# EAGLE design DWM Breakout (EAGLE 9.1.3)
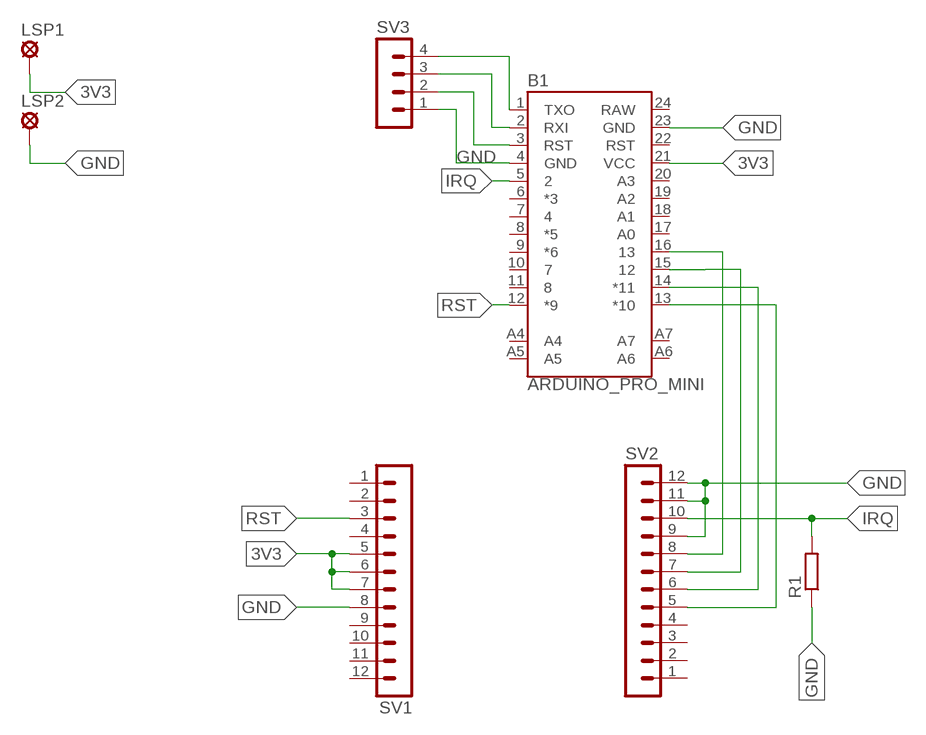
[diagram p0: schematic, sheet 1]

## Parts
B1  ARDUINO_PRO_MINI  [ARDUINO_PRO_MINI]
LSP1  SE14  [SE14]
LSP2  SE14  [SE14]
R1  R-EU_0207/10  [0207/10]
SV1  MA12-1  [MA12-1]
SV2  MA12-1  [MA12-1]
SV3  MA04-1  [MA04-1]

## Nets
3V3: B1.21(VCC) LSP1.MP SV1.5 SV1.6 SV1.7
GND: B1.4(GND) B1.23(GND) LSP2.MP R1.1 SV1.8 SV2.9 SV2.11 SV2.12 SV3.1
IRQ: B1.5 R1.2 SV2.10
N$2: B1.15 SV2.7
N$3: B1.1(TXO) SV3.4
N$4: B1.16 SV2.8
N$5: B1.14(*11) SV2.6
N$6: B1.13(*10) SV2.5
N$7: B1.2(RXI) SV3.3
N$8: B1.3(RST) SV3.2
RST: B1.12(*9) SV1.3
Unconnected: B1.6(*3) B1.7 B1.8(*5) B1.9(*6) B1.10 B1.11 B1.17(A0) B1.18(A1) B1.19(A2) B1.20(A3) B1.22(RST) B1.A4 B1.A5 B1.A6 B1.A7 SV1.1 SV1.2 SV1.4 SV1.9 SV1.10 SV1.11 SV1.12 SV2.1 SV2.2 SV2.3 SV2.4

## Power pins joined to a net without a drawn wire
RAW: B1.24(RAW)

## Library data of the parts
B1 = SparkFun-Boards:ARDUINO_PRO_MINI: SparkFun Pro Mini Pro Mini compatible footprint. Dimensions: 0.7 x 1.3" PCB Thickness: 0.8mm SparkFun Products: 3.3V/8MHz <https://www.sparkfun.com/products/11114> 5V/16MHz <https://www.sparkfun.com/products/11113>
LSP1 LSP2 = solpad:SE14: SOLDER PAD E1553, drill 1,4mm, distributor Buerklin, 07F820
R1 = rcl:R-EU_: RESISTOR, European symbol; SPICEPREFIX: R
SV1 SV2 = con-lstb:MA12-1: PIN HEADER; OC_FARNELL: unknown; OC_NEWARK: unknown
SV3 = con-lstb:MA04-1: PIN HEADER; OC_FARNELL: unknown; OC_NEWARK: unknown

## Net classes
0 default: width 0.305 mm

## Board
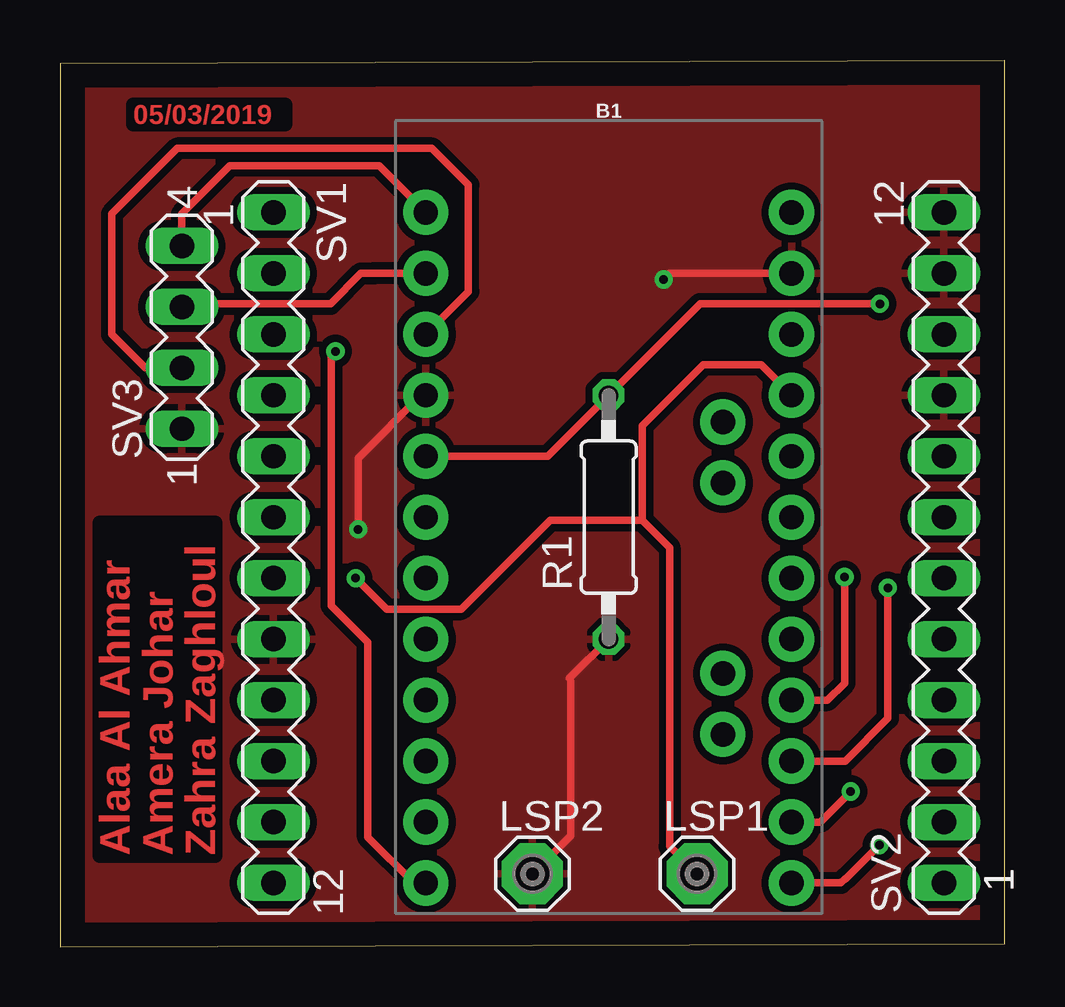
[diagram p1: board, top side]
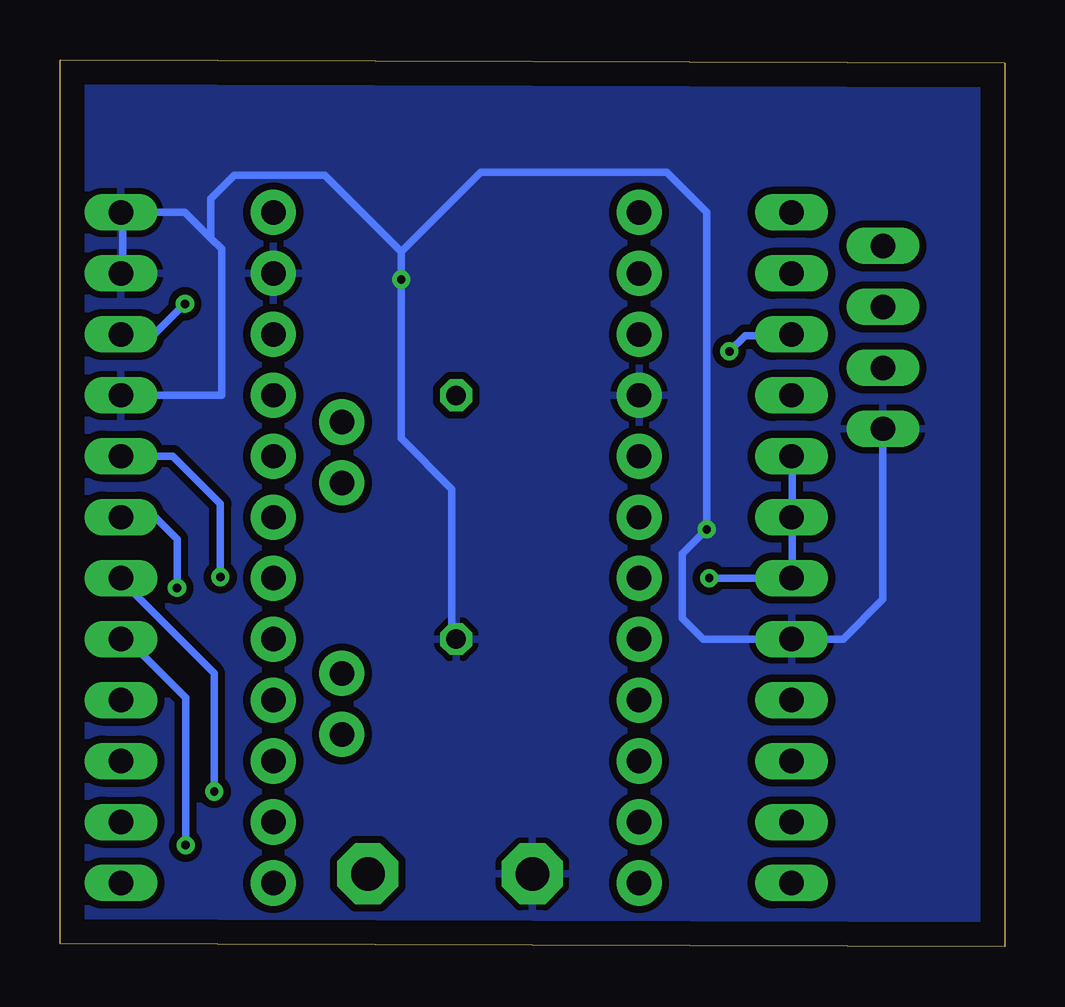
[diagram p2: board, bottom side, seen from below]

Size 39.37 x 36.96 mm. Coordinates in mm from the lower left corner, seen from the top.
Outline: 0,0 39.37,0.13 39.37,36.96 0,36.83 0,0
Copper layers (1*16): Top 0.035mm / dielectric 1.5mm / Bottom 0.035mm
Design rules "default": minimum track width 6mil, minimum drill 0.35mm, track to track 6mil, track to pad 6mil, pad to pad 6mil, via to via 6mil, smd to smd 6mil, copper to edge 40mil, drill to drill 6mil, minimum pad ring 10mil, minimum via ring 8mil, stop-mask expansion 4mil, vias tented up to drill 0mil, thermal gap 10mil

### Footprints (pad centres in the part's own frame; a part is rotated, then mirrored left to right if it is on the bottom)
ARDUINO_PRO_MINI = drill 1.016 pad 1.88: 1 -7.62,12.7; 2 -7.62,10.16; 3 -7.62,7.62; 4 -7.62,5.08; 5 -7.62,2.54; 6 -7.62,0; 7 -7.62,-2.54; 8 -7.62,-5.08; 9 -7.62,-7.62; 10 -7.62,-10.16; 11 -7.62,-12.7; 12 -7.62,-15.24; 13 7.62,-15.24; 14 7.62,-12.7; 15 7.62,-10.16; 16 7.62,-7.62; 17 7.62,-5.08; 18 7.62,-2.54; 19 7.62,0; 20 7.62,2.54; 21 7.62,5.08; 22 7.62,7.62; 23 7.62,10.16; 24 7.62,12.7; A4 4.763,1.429; A5 4.763,3.969; A6 4.763,-9.049; A7 4.763,-6.509
SE14 = drill 1.397 pad 2.54 octagon: MP 0,0
0207/10 = drill 0.813 octagon: 1 -5.08,0; 2 5.08,0
MA12-1 = drill 1.016 long: 1 -13.97,0; 2 -11.43,0; 3 -8.89,0; 4 -6.35,0; 5 -3.81,0; 6 -1.27,0; 7 1.27,0; 8 3.81,0; 9 6.35,0; 10 8.89,0; 11 11.43,0; 12 13.97,0
MA04-1 = drill 1.016 long: 1 -3.81,0; 2 -1.27,0; 3 1.27,0; 4 3.81,0

### Placement (x,y rotation side)
B1  22.86,17.91 0 top
LSP1  26.54,3.05 0 top
LSP2  19.69,3.05 0 top
R1  22.86,17.91 90 top
SV1  8.89,16.64 270 top
SV2  36.83,16.64 90 top
SV3  5.08,25.4 90 top

### Tracks (layer width: path | path; a pad name or v marks a point on that pad's centre or on a via)
3V3  (via drill 0.35)
  Top 0.305: v12.32,15.37 13.61,14.07 16.71,14.07 20.42,17.78 24.26,17.78 | 24.26,17.78 25.4,16.64 25.4,4.19 LSP1.MP | B1.21 29.21,24.26 26.8,24.26 24.26,21.72 24.26,17.78
  Bottom 0.305: 8.87,15.44 8.87,17.73 SV1.6 8.87,17.96 8.87,20.24 SV1.5 | 8.87,15.44 SV1.7 | v12.32,15.37 8.87,15.37 8.87,15.44
GND  (via drill 0.35)
  Top 0.305: v12.42,17.4 12.42,20.37 15.04,22.99 B1.4 | R1.1 21.23,11.19 21.27,11.08 21.27,4.63 LSP2.MP | B1.23 25.41,28.07 v25.15,27.81
  Bottom 0.305: 22.81,12.7 R1.1 23.04,12.93 23.04,19.07 25.15,21.19 v25.15,27.81 25.15,28.96 | 36.75,22.99 SV2.9 32.64,22.99 32.64,29.08 33.08,29.53 | SV2.11 36.75,28.24 36.75,30.53 SV2.12 34.16,30.61 33.08,29.53 | 25.15,28.96 21.83,32.28 14.1,32.28 12.42,30.61 v12.42,17.4 13.44,16.38 13.44,13.69 12.57,12.83 SV1.8 6.73,12.83 5.08,14.48 SV3.1 5.08,21.56 | 25.15,28.96 28.35,32.16 32.11,32.16 33.08,31.18 33.08,29.53
  pour Top (isolate 0.305): 39.24,36.83 39.24,0.13 0.13,0.13 0.13,36.83
  pour Bottom (isolate 0.305): 0.13,36.83 39.37,36.83 39.37,0.25 0.13,0.25
IRQ  (via drill 0.35)
  Top 0.305: v34.16,26.8 26.8,26.8 26.67,26.8 R1.2 20.32,20.45 B1.5
  Bottom 0.305: SV2.10 35.43,25.53 v34.16,26.8
N$2  (via drill 0.35)
  Top 0.305: v34.49,14.96 34.49,9.53 32.71,7.75 B1.15
  Bottom 0.305: v34.49,14.96 34.49,16.99 35.41,17.91 SV2.7
N$3
  Top 0.305: B1.1 13.3,32.54 7.08,32.54 5.08,30.54 5.08,29.34 SV3.4
N$4  (via drill 0.35)
  Top 0.305: v32.69,15.42 32.69,11 31.98,10.29 B1.16
  Bottom 0.305: v32.69,15.42 32.69,18.47 34.67,20.45 SV2.8
N$5  (via drill 0.35)
  Top 0.305: v32.94,6.48 31.67,5.21 B1.14
  Bottom 0.305: v32.94,6.48 32.94,11.41 36.75,15.21 SV2.6
N$6  (via drill 0.35)
  Top 0.305: v34.14,4.24 32.74,2.84 32.71,2.84 32.54,2.67 B1.13
  Bottom 0.305: v34.14,4.24 34.14,10.39 36.58,12.83 SV2.5
N$7
  Top 0.305: 13.08,28.07 12.99,28.07 | B1.2 13.08,28.07 | 13.08,28.07 12.54,28.07 11.27,26.8 5.21,26.8 SV3.3
N$8
  Top 0.305: B1.3 17.02,27.3 17.02,31.75 15.49,33.27 4.89,33.27 2.16,30.54 2.16,25.53 3.56,24.13 SV3.2
RST  (via drill 0.35)
  Top 0.305: B1.12 14.73,2.67 12.83,4.57 12.83,12.7 11.3,14.22 11.3,24.64 v11.48,24.82
  Bottom 0.305: SV1.3 8.84,25.48 10.82,25.48 v11.48,24.82

### Text on the board
Top: 05/03/2019 | Alaa Al Ahmar / Amera Johar / Zahra Zaghloul